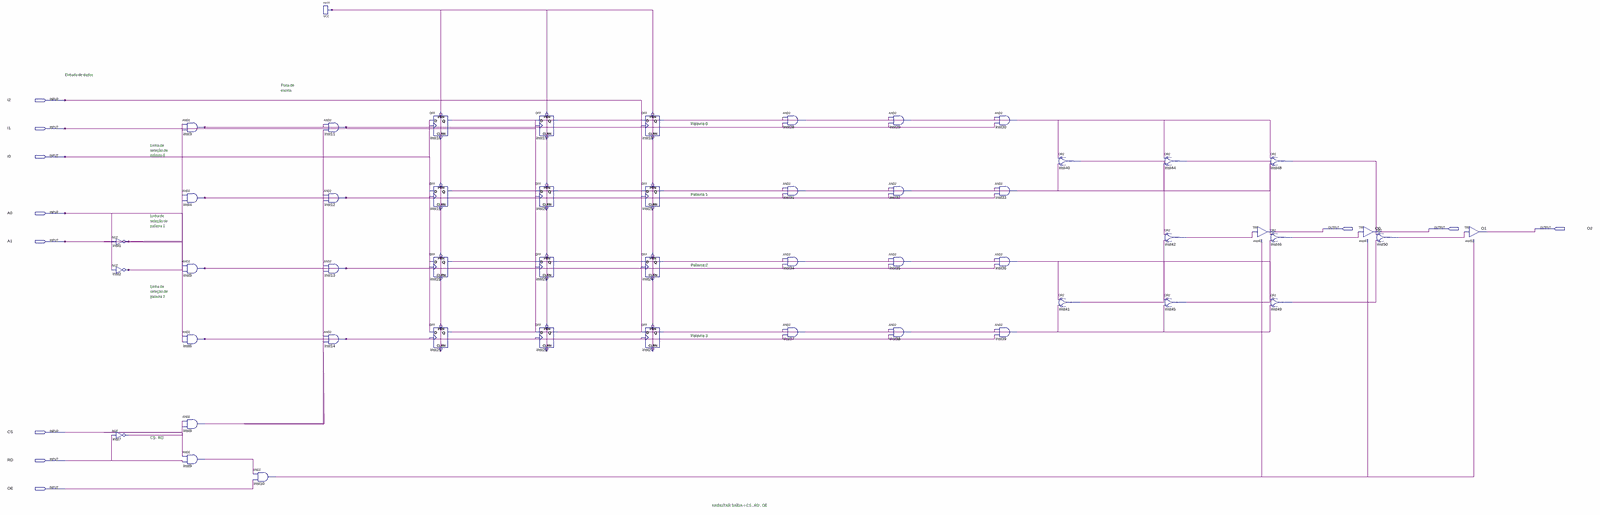
[diagram p0: schematic sheet, whole]
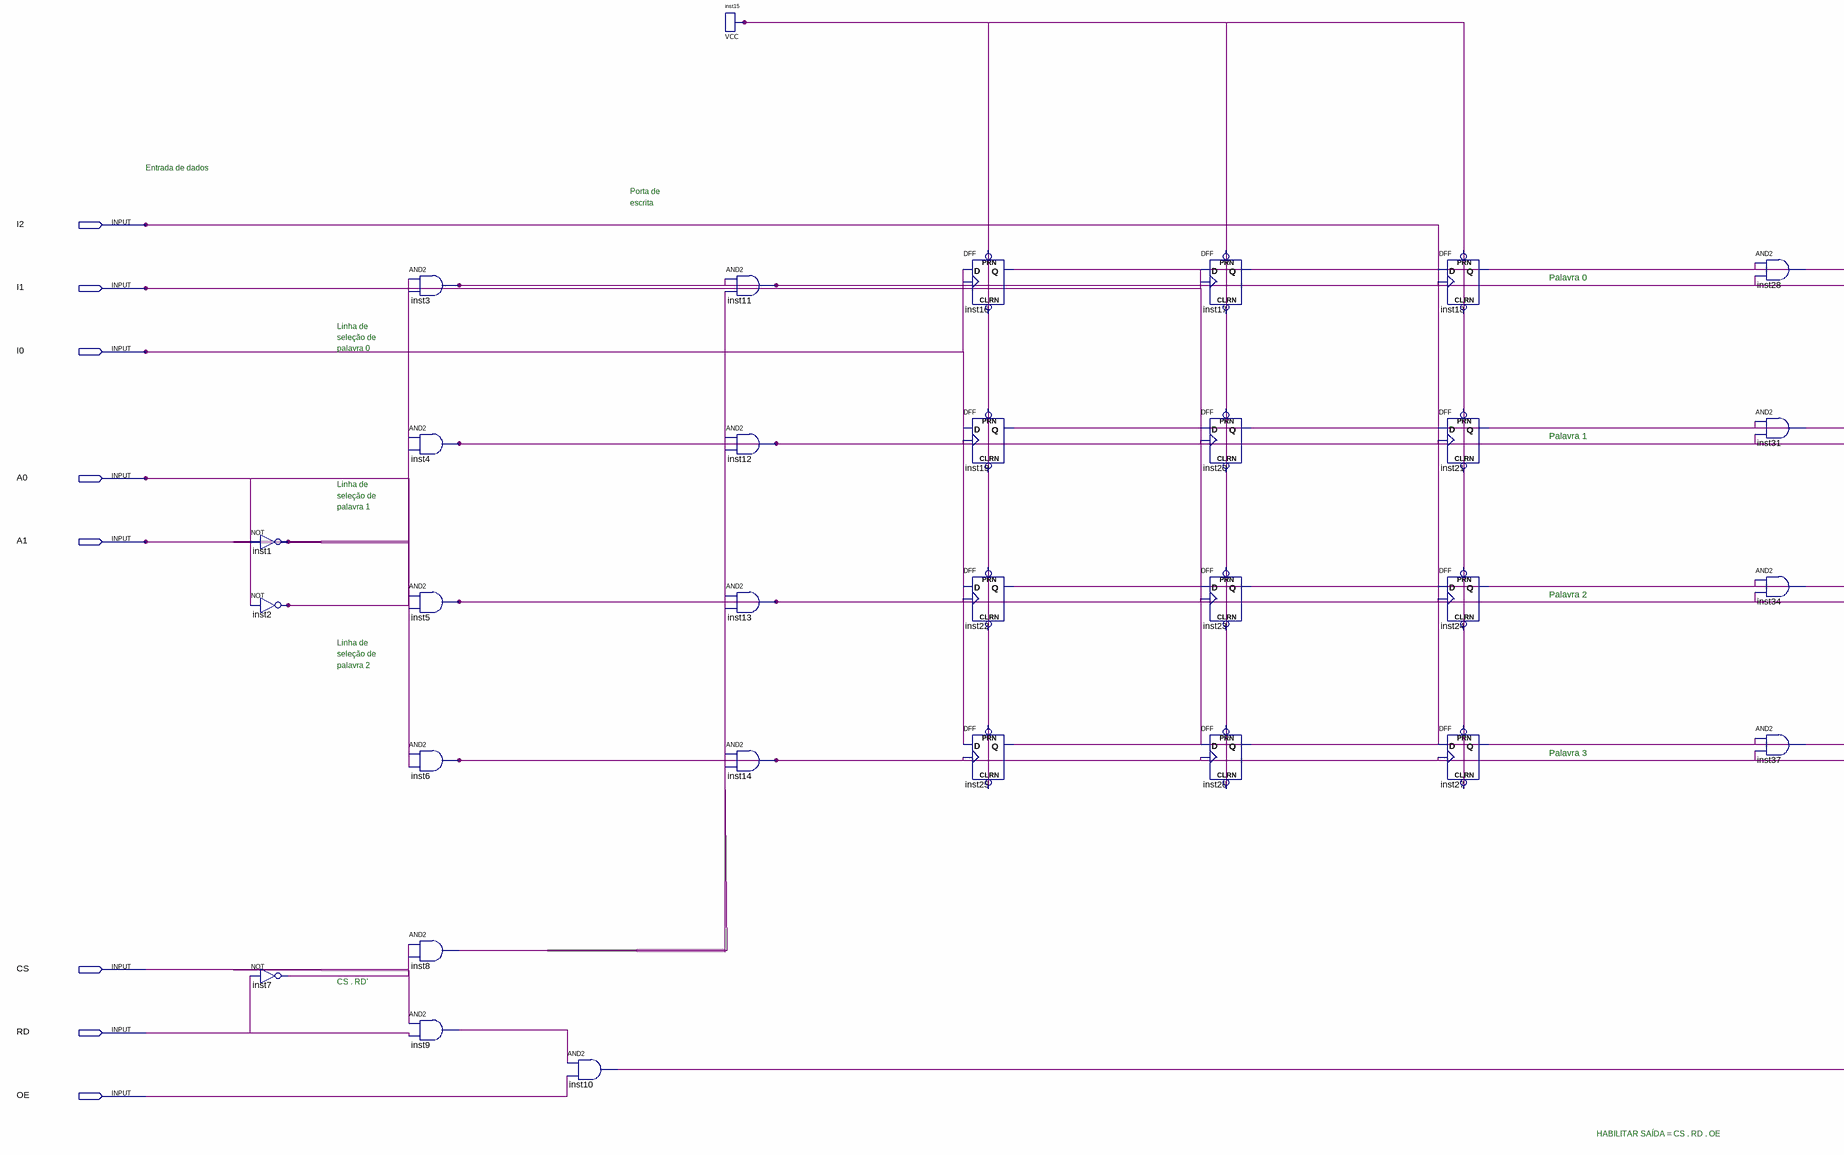
[diagram p1: schematic sheet, left part]
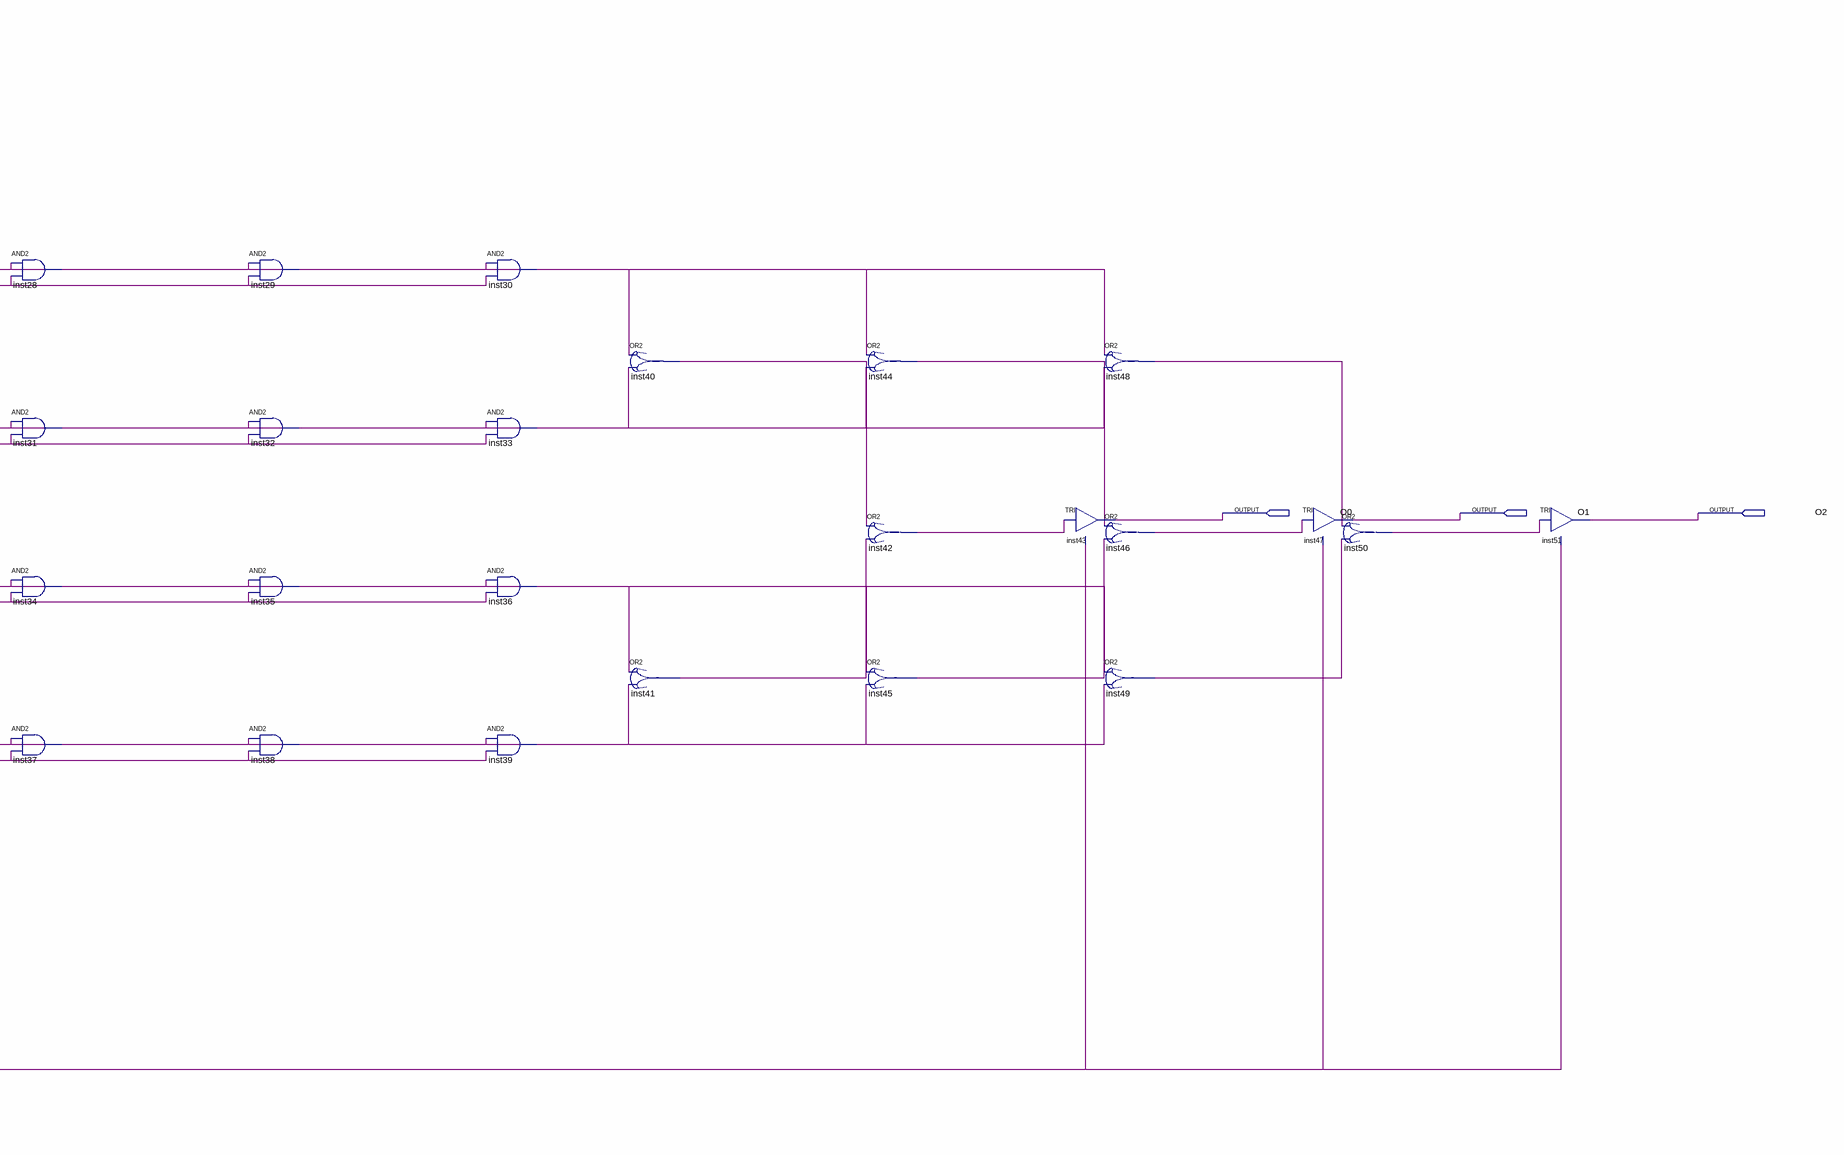
[diagram p2: schematic sheet, right part]
// Quartus schematic Memory_4x3.bdf as structural Verilog: 50 symbols, 11 pins
module Memory_4x3 (
  input  I2,
  input  I1,
  input  I0,
  input  A0,
  input  A1,
  input  CS,
  input  RD,
  input  OE,
  output O0,
  output O1,
  output O2
);

  wire inst1_out, inst2_out, inst3_out, inst4_out, inst5_out, inst6_out, inst7_out, inst8_out, inst9_out,
       inst10_out, inst16_q, inst17_q, inst18_q, inst19_q, inst20_q, inst21_q, inst22_q, inst23_q, inst24_q,
       inst25_q, inst26_q, inst27_q, inst28_out, inst29_out, inst30_out, inst31_out, inst32_out, inst33_out,
       inst34_out, inst35_out, inst36_out, inst37_out, inst38_out, inst39_out, inst40_out, inst41_out,
       inst42_out, inst44_out, inst45_out, inst46_out, inst48_out, inst49_out, inst50_out;

  not inst1 (inst1_out, A1);
  not inst2 (inst2_out, A0);
  not inst7 (inst7_out, RD);
  and inst3 (inst3_out, inst1_out, inst2_out);
  and inst4 (inst4_out, inst1_out, A0);
  and inst5 (inst5_out, A1, inst2_out);
  and inst6 (inst6_out, A1, A0);
  and inst8 (inst8_out, CS, inst7_out);
  and inst9 (inst9_out, CS, RD);
  and inst10 (inst10_out, inst9_out, OE);
  and inst11 (inst3_out, inst3_out, inst8_out);
  and inst12 (inst4_out, inst4_out, inst8_out);
  and inst13 (inst5_out, inst5_out, inst8_out);
  and inst14 (inst6_out, inst6_out, inst8_out);
  DFF inst16 (.CLRN(1'b1), .CLK(inst3_out), .D(I0), .PRN(1'b1), .Q(inst16_q));
  DFF inst19 (.CLRN(1'b1), .CLK(inst4_out), .D(I0), .PRN(1'b1), .Q(inst19_q));
  DFF inst22 (.CLRN(1'b1), .CLK(inst5_out), .D(I0), .PRN(1'b1), .Q(inst22_q));
  DFF inst25 (.CLRN(1'b1), .CLK(inst6_out), .D(I0), .PRN(1'b1), .Q(inst25_q));
  DFF inst17 (.CLRN(1'b1), .CLK(inst3_out), .D(I1), .PRN(1'b1), .Q(inst17_q));
  DFF inst20 (.CLRN(1'b1), .CLK(inst4_out), .D(I1), .PRN(1'b1), .Q(inst20_q));
  DFF inst23 (.CLRN(1'b1), .CLK(inst5_out), .D(I1), .PRN(1'b1), .Q(inst23_q));
  DFF inst26 (.CLRN(1'b1), .CLK(inst6_out), .D(I1), .PRN(1'b1), .Q(inst26_q));
  DFF inst18 (.CLRN(1'b1), .CLK(inst3_out), .D(I2), .PRN(1'b1), .Q(inst18_q));
  DFF inst21 (.CLRN(1'b1), .CLK(inst4_out), .D(I2), .PRN(1'b1), .Q(inst21_q));
  DFF inst24 (.CLRN(1'b1), .CLK(inst5_out), .D(I2), .PRN(1'b1), .Q(inst24_q));
  DFF inst27 (.CLRN(1'b1), .CLK(inst6_out), .D(I2), .PRN(1'b1), .Q(inst27_q));
  and inst28 (inst28_out, inst16_q, inst3_out);
  and inst31 (inst31_out, inst19_q, inst4_out);
  and inst34 (inst34_out, inst22_q, inst5_out);
  and inst37 (inst37_out, inst25_q, inst6_out);
  and inst29 (inst29_out, inst17_q, inst3_out);
  and inst32 (inst32_out, inst20_q, inst4_out);
  and inst35 (inst35_out, inst23_q, inst5_out);
  and inst38 (inst38_out, inst26_q, inst6_out);
  and inst30 (inst30_out, inst18_q, inst3_out);
  and inst33 (inst33_out, inst21_q, inst4_out);
  and inst36 (inst36_out, inst24_q, inst5_out);
  and inst39 (inst39_out, inst27_q, inst6_out);
  or inst40 (inst40_out, inst28_out, inst31_out);
  or inst41 (inst41_out, inst34_out, inst37_out);
  or inst44 (inst44_out, inst29_out, inst32_out);
  or inst42 (inst42_out, inst40_out, inst41_out);
  or inst45 (inst45_out, inst35_out, inst38_out);
  TRI inst43 (.IN(inst42_out), .EN(inst10_out), .OUT(O0));
  or inst48 (inst48_out, inst30_out, inst33_out);
  or inst46 (inst46_out, inst44_out, inst45_out);
  or inst49 (inst49_out, inst36_out, inst39_out);
  TRI inst47 (.IN(inst46_out), .EN(inst10_out), .OUT(O1));
  or inst50 (inst50_out, inst48_out, inst49_out);
  TRI inst51 (.IN(inst50_out), .EN(inst10_out), .OUT(O2));

  // Notes on the sheet:
  //   Entrada de dados
  //   Porta de
  //   escrita
  //   Palavra 0
  //   Linha de
  //   seleção de
  //   palavra 0
  //   Palavra 1
  //   Linha de
  //   seleção de
  //   palavra 1
  //   Palavra 2
  //   Linha de
  //   seleção de
  //   palavra 2
  //   Palavra 3
  //   CS . RD'
  //   HABILITAR SAÍDA = CS . RD . OE
endmodule
